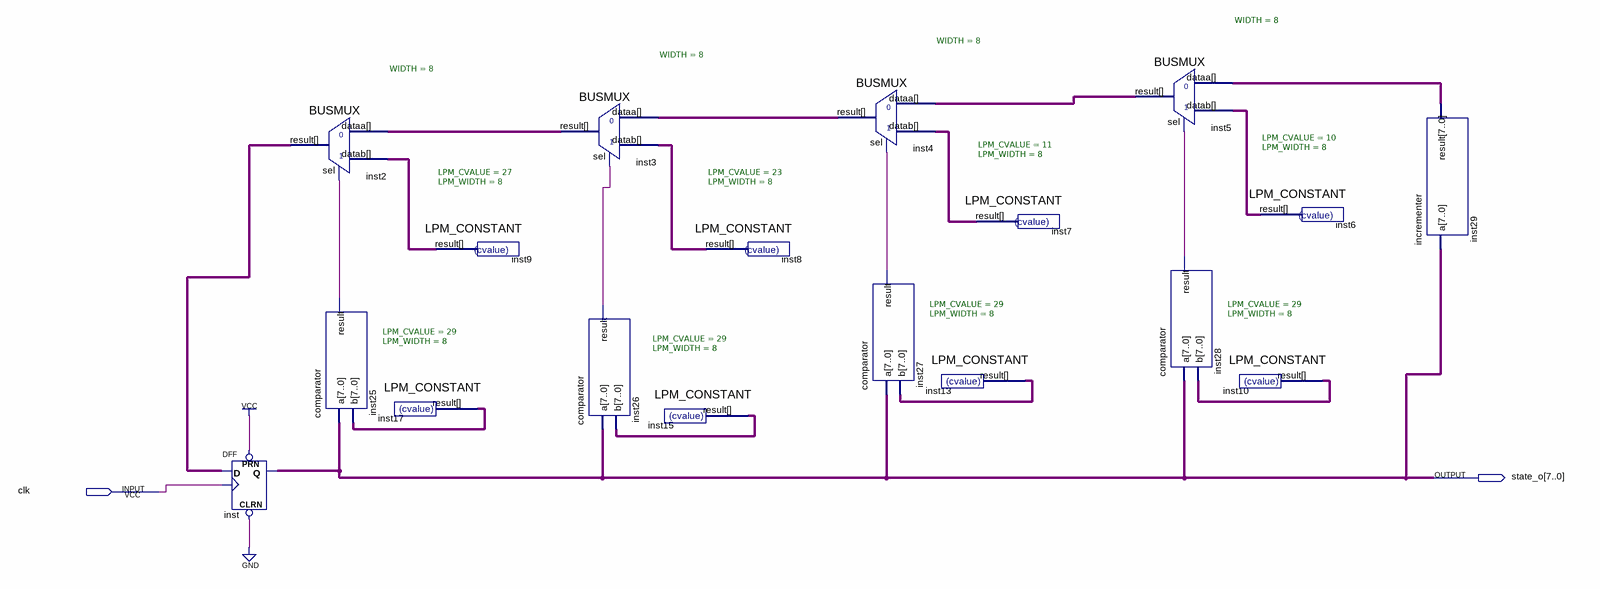
[diagram p0: schematic sheet]
// Quartus schematic top.bdf as structural Verilog: 18 symbols, 2 pins
module top (
  input  clk,
  output [7:0] state_o
);

  wire inst25_result, inst26_result, inst27_result, inst28_result;
  wire [7:0] inst2_result, inst3_result, inst4_result, inst5_result, inst6_result, inst7_result,
       inst8_result, inst9_result, inst10_result, inst13_result, inst15_result, inst17_result, inst29_result;

  DFF inst[7:0] (.CLRN(1'b0), .CLK(clk), .D(inst2_result), .PRN(1'b1), .Q(state_o));
  BUSMUX #(.WIDTH(8)) inst2 (.datab(inst9_result), .sel(inst25_result), .dataa(inst3_result), .result(inst2_result));
  comparator inst25 (.a(state_o), .b(inst17_result), .result(inst25_result));
  LPM_CONSTANT #(.LPM_CVALUE(29), .LPM_WIDTH(8)) inst17 (.result(inst17_result));
  LPM_CONSTANT #(.LPM_CVALUE(27), .LPM_WIDTH(8)) inst9 (.result(inst9_result));
  BUSMUX #(.WIDTH(8)) inst3 (.datab(inst8_result), .sel(inst26_result), .dataa(inst4_result), .result(inst3_result));
  comparator inst26 (.a(state_o), .b(inst15_result), .result(inst26_result));
  LPM_CONSTANT #(.LPM_CVALUE(29), .LPM_WIDTH(8)) inst15 (.result(inst15_result));
  LPM_CONSTANT #(.LPM_CVALUE(23), .LPM_WIDTH(8)) inst8 (.result(inst8_result));
  BUSMUX #(.WIDTH(8)) inst4 (.datab(inst7_result), .sel(inst27_result), .dataa(inst5_result), .result(inst4_result));
  comparator inst27 (.a(state_o), .b(inst13_result), .result(inst27_result));
  LPM_CONSTANT #(.LPM_CVALUE(29), .LPM_WIDTH(8)) inst13 (.result(inst13_result));
  LPM_CONSTANT #(.LPM_CVALUE(11), .LPM_WIDTH(8)) inst7 (.result(inst7_result));
  BUSMUX #(.WIDTH(8)) inst5 (.datab(inst6_result), .sel(inst28_result), .dataa(inst29_result), .result(inst5_result));
  comparator inst28 (.a(state_o), .b(inst10_result), .result(inst28_result));
  LPM_CONSTANT #(.LPM_CVALUE(10), .LPM_WIDTH(8)) inst6 (.result(inst6_result));
  LPM_CONSTANT #(.LPM_CVALUE(29), .LPM_WIDTH(8)) inst10 (.result(inst10_result));
  incrementer inst29 (.a(state_o), .result(inst29_result));
endmodule
